# EAGLE schematic node5 (EAGLE 5.10)
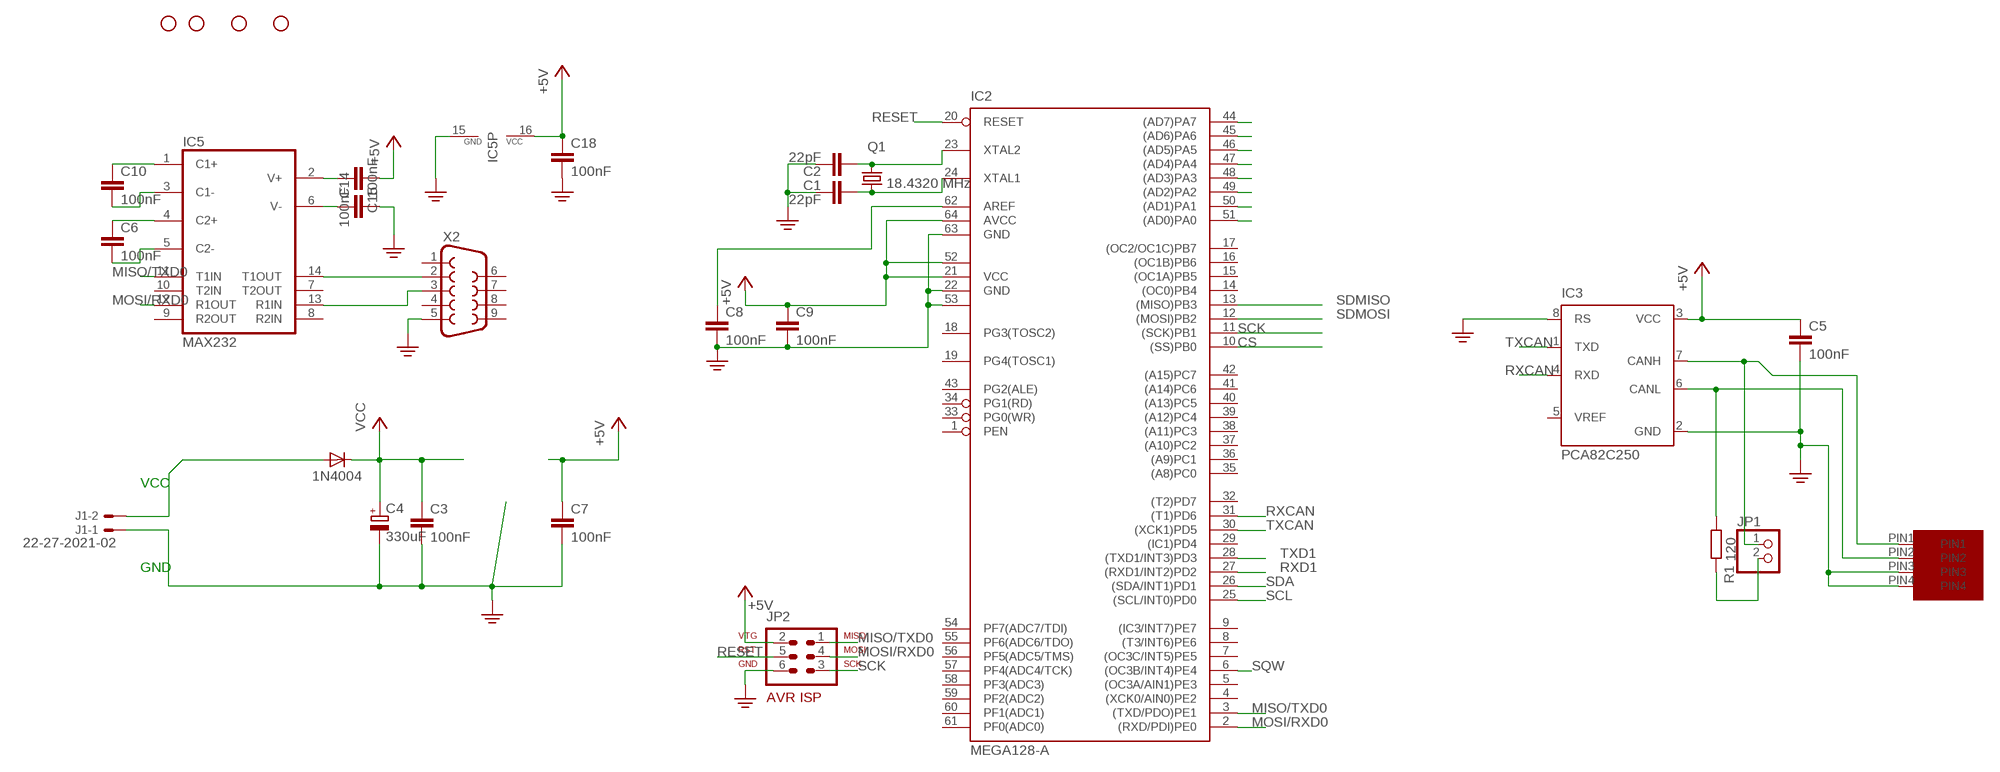
[diagram p0: schematic, sheet 1]

## Parts
C1  22pF  C5/2.5  [C5B2.5]
C2  22pF  C5/2.5  [C5B2.5]
C3  100nF  C-EU050-024X044  [C050-024X044]
C4  330uF  CPOL-EUE15-5AXIAL  [E15-5]
C5  100nF  C-EU050-024X044  [C050-024X044]
C6  100nF  C-EU050-024X044  [C050-024X044]
C7  100nF  C-EU050-024X044  [C050-024X044]
C8  100nF  C-EU050-024X044  [C050-024X044]
C9  100nF  C-EU050-024X044  [C050-024X044]
C10  100nF  C-EU050-024X044  [C050-024X044]
C14  100nF  C-EU050-024X044  [C050-024X044]
C15  100nF  C-EU050-024X044  [C050-024X044]
C18  100nF  C-EU050-024X044  [C050-024X044]
D1  1N4004  [DO41-10]
IC2  MEGA128-A  [TQFP64]
IC3  PCA82C250  [DIL08]
IC5  MAX232  [DIL16]
J1  22-27-2021-02  [6410-02]
JP1  PINHD-1X2  [1X02]
JP2  AVR-ISP-6  [AVR-ISP-6]
JP3  STAND-OFF  [STAND-OFF]
JP4  STAND-OFF  [STAND-OFF]
JP5  STAND-OFF  [STAND-OFF]
JP6  STAND-OFF  [STAND-OFF]
Q1  18.4320 MHz  CRYSTALHC49U70  [HC49U70]
R1  120  R-EU_0207/10  [0207/10]
U$1  MICROFIT4  [MICROFIT4SOCK]
X2  DB9  [DB9]

## Nets
+5V: C5.1 C7.1 C9.1 C15.1 C18.1 IC2.21(VCC) IC2.52(VCC1) IC2.64(AVCC) IC3.3(VCC) IC5.16(VCC) JP2.2
CANJUMP1: IC3.7(CANH) JP1.1 U$1.PIN1
CANJUMP2: JP1.2 R1.2
CS: IC2.10((SS)PB0)
MISO/TXD0: IC2.3((TXD/PDO)PE1) IC5.11(T1IN) JP2.1
MOSI/RXD0: IC2.2((RXD/PDI)PE0) IC5.12(R1OUT) JP2.4
N$1: C1.2 IC2.24(XTAL1) Q1.1
N$2: C2.2 IC2.23(XTAL2) Q1.2
N$3: IC2.44((AD7)PA7)
N$4: IC2.45((AD6)PA6)
N$5: D1.A J1.2
N$6: IC2.46((AD5)PA5)
N$7: IC2.47((AD4)PA4)
N$10: C8.1 IC2.62(AREF)
N$14: IC2.48((AD3)PA3)
N$15: IC2.49((AD2)PA2)
N$16: IC2.50((AD1)PA1)
N$17: IC2.51((AD0)PA0)
N$21: IC5.13(R1IN) X2.3
N$33: IC5.14(T1OUT) X2.2
N$35: C10.1 IC5.1(C1+)
N$36: C10.2 IC5.3(C1-)
N$37: C6.1 IC5.4(C2+)
N$38: C6.2 IC5.5(C2-)
N$39: C14.1 IC5.6(V-)
N$41: C15.2 IC5.2(V+)
N$51: IC3.6(CANL) R1.1 U$1.PIN2
PE: C1.1 C2.1 C3.2 C4.- C5.2 C7.2 C8.2 C9.2 C14.2 C18.2 IC2.22(GND) IC2.53(GND1) IC2.63(GND) IC3.2(GND) IC3.8(RS) IC5.15(GND) J1.1 JP2.6 U$1.PIN3 U$1.PIN4 X2.5
RESET: IC2.20(RESET) JP2.5
RXCAN: IC2.31((T1)PD6) IC3.4(RXD)
RXD1: IC2.27((RXD1/INT2)PD2)
SCK: IC2.11((SCK)PB1) JP2.3
SCL: IC2.25((SCL/INT0)PD0)
SDA: IC2.26((SDA/INT1)PD1)
SDMISO: IC2.13((MISO)PB3)
SDMOSI: IC2.12((MOSI)PB2)
SQW: IC2.6((OC3B/INT4)PE4)
TXCAN: IC2.30((XCK1)PD5) IC3.1(TXD)
TXD1: IC2.28((TXD1/INT3)PD3)
VCC: C3.1 C4.+ D1.C
Unconnected: IC2.1(PEN) IC2.4((XCK0/AIN0)PE2) IC2.5((OC3A/AIN1)PE3) IC2.7((OC3C/INT5)PE5) IC2.8((T3/INT6)PE6) IC2.9((IC3/INT7)PE7) IC2.14((OC0)PB4) IC2.15((OC1A)PB5) IC2.16((OC1B)PB6) IC2.17((OC2/OC1C)PB7) IC2.18(PG3(TOSC2)) IC2.19(PG4(TOSC1)) IC2.29((IC1)PD4) IC2.32((T2)PD7) IC2.33(PG0(WR)) IC2.34(PG1(RD)) IC2.35((A8)PC0) IC2.36((A9)PC1) IC2.37((A10)PC2) IC2.38((A11)PC3) IC2.39((A12)PC4) IC2.40((A13)PC5) IC2.41((A14)PC6) IC2.42((A15)PC7) IC2.43(PG2(ALE)) IC2.54(PF7(ADC7/TDI)) IC2.55(PF6(ADC6/TDO)) IC2.56(PF5(ADC5/TMS)) IC2.57(PF4(ADC4/TCK)) IC2.58(PF3(ADC3)) IC2.59(PF2(ADC2)) IC2.60(PF1(ADC1)) IC2.61(PF0(ADC0)) IC3.5(VREF) IC5.7(T2OUT) IC5.8(R2IN) IC5.9(R2OUT) IC5.10(T2IN) X2.1 X2.4 X2.6 X2.7 X2.8 X2.9

## Notes on the sheet
- VCC
- GND

## Library data of the parts
C1 C2 = capacitor-wima:C: CAPACITOR naming: grid - package width
C3 C5-C10 C14 C15 C18 = rcl:C-EU: CAPACITOR, European symbol
C4 = rcl:CPOL-EU: POLARIZED CAPACITOR, European symbol
D1 = diode:1N4004: DIODE general purpose rectifier, 1 A
IC2 = atmel:MEGA128: MICROCONTROLLER 128 Kbytes FLASH 4 Kbytes SRAM 4 Kbytes EEPROM DUAL USART 8-channel 10 bit ADC Source: avr.lbr
IC3 = micro-philips:PCA82C250: CAN CONTROLLER INTERFACE
IC5 = maxim:MAX232: RS232 TRANSEIVER
J1 = con-molex:22-?-02: CONNECTOR wire to board 2.54 mm (.1 inch) pitch header
JP1 = pinhead:PINHD-1X2: PIN HEADER
JP2 = avr-5:AVR-ISP-6: AVR ISP-6 Serial Programming Header
JP3-JP6 = SparkFun:STAND-OFF: Stand Off This is the mechanical footprint for a #4 phillips button head screw. Use the keepout ring to avoid running the screw head into surrounding components. SKU : PRT-00447
Q1 = crystal:CRYSTAL: CRYSTAL
R1 = resistor:R-EU_: RESISTOR, European symbol
U$1 = UNICORN:MICROFIT4
X2 = SparkFun:DB9: DB9 Connector Standard DB9 (D-Sub 9) serial connector. Can be used for CAN bus as well as RS485 and RS232. Footprint production proven. Spark Fun Electronics SKU : PRT-00429